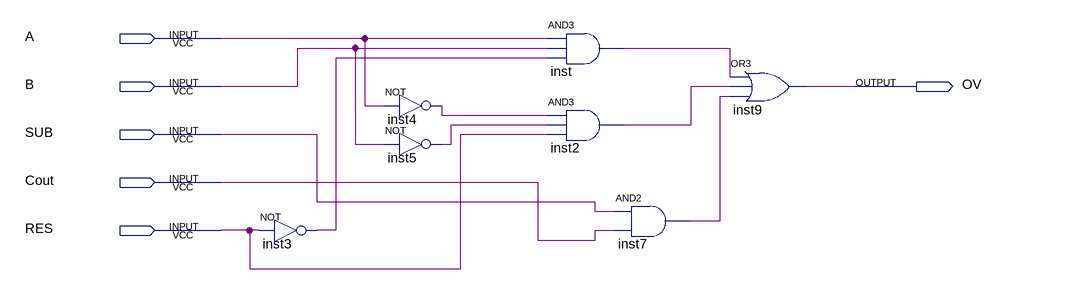
[diagram p0: schematic sheet]
// Quartus schematic overflowcheck.bdf as structural Verilog: 7 symbols, 6 pins
module overflowcheck (
  input  A,
  input  B,
  input  SUB,
  input  Cout,
  input  RES,
  output OV
);

  wire inst2_out, inst3_out, inst4_out, inst5_out, inst7_out, inst_out;

  not inst3 (inst3_out, RES);
  not inst4 (inst4_out, A);
  not inst5 (inst5_out, B);
  and inst (inst_out, A, B, inst3_out);
  and inst2 (inst2_out, inst4_out, inst5_out, RES);
  and inst7 (inst7_out, SUB, Cout);
  or inst9 (OV, inst_out, inst2_out, inst7_out);
endmodule
